# EAGLE design TRV_W5200 (EAGLE 6.4)

## Sheet 1 of 2
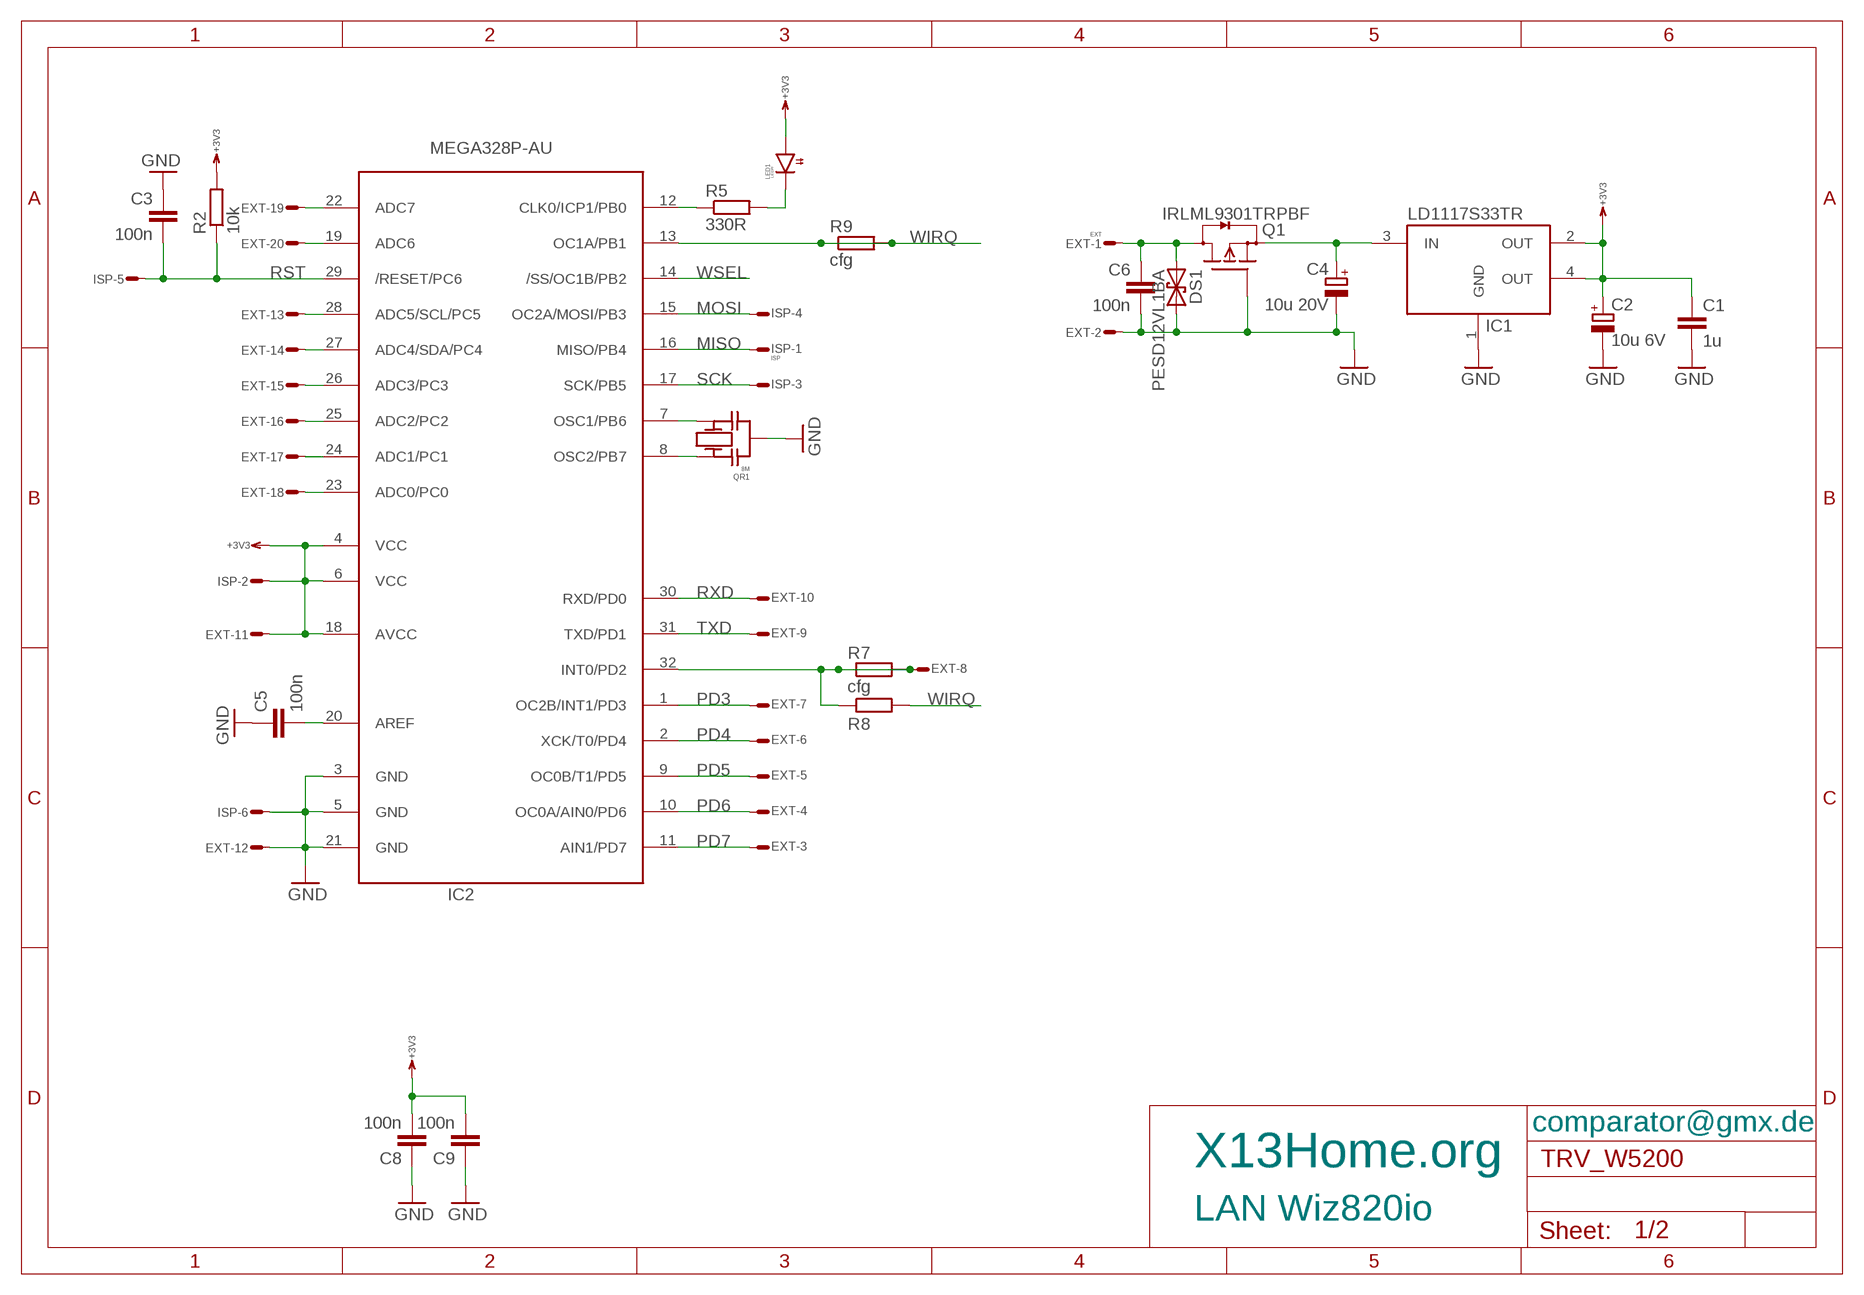
[diagram p0: schematic, sheet 1]

### Parts
C1  1u  C0603  [0603]
C2  10u 6V  C_POLSMCA  [SMC_A]
C3  100n  C0603  [0603]
C4  10u 20V  C_POLSMCB  [SMC_B]
C5  100n  C0603  [0603]
C6  100n  C0603  [0603]
C8  100n  C0603  [0603]
C9  100n  C0603  [0603]
DS1  PESD12VL1BA  TVS-U323  [SOD323]
EXT  EXT  ML20SE  [ML20S]
IC1  LD1117S33TR  LDO_4P  [SOT223]
IC2  MEGA328P-AU  MEGA168PA  [TQFP32-08]
ISP  ISP  ML6ES  [ML6S]
LED1  LEDR  LEDT134  [T1-3/4]
Q1  IRLML9301TRPBF  FET-PDSOT23  [SOT23]
QR1  8M  QRCE  [CSTCE]
R2  10k  R0603  [0603]
R5  330R  R0603  [0603]
R7  cfg  R0402  [0402]
R8  cfg  R0402  [0402]
R9  cfg  R0402  [0402]

### Nets
+3V3: C1.1 C2.+ C8.2 C9.2 EXT.11 IC1.2(OUT) IC1.4(OUT) IC2.4(VCC) IC2.6(VCC) IC2.18(AVCC) ISP.2 LED1.A R2.2 ; also sheet 2
GND: C1.2 C2.- C3.1 C4.- C5.1 C6.2 C8.1 C9.1 DS1.C EXT.2 EXT.12 IC1.1(GND) IC2.3(GND) IC2.5(GND) IC2.21(GND) ISP.6 Q1.1(G) QR1.G(M) ; also sheet 2
MISO: IC2.16(MISO/PB4) ISP.1 ; also sheet 2
MOSI: IC2.15(OC2A/MOSI/PB3) ISP.4 ; also sheet 2
N$2: C6.1 DS1.A EXT.1 Q1.3(D)
N$3: EXT.19 IC2.22(ADC7)
N$4: C4.+ IC1.3(IN) Q1.2(S)
N$6: C5.2 IC2.20(AREF)
N$7: IC2.8(OSC2/PB7) QR1.A
N$8: IC2.7(OSC1/PB6) QR1.B
N$10: IC2.12(CLK0/ICP1/PB0) R5.1
N$11: EXT.8 IC2.32(INT0/PD2) R7.1 R7.2 R8.1
N$15: EXT.20 IC2.19(ADC6)
N$21: LED1.C R5.2
PC0: EXT.18 IC2.23(ADC0/PC0)
PC1: EXT.17 IC2.24(ADC1/PC1)
PC2: EXT.16 IC2.25(ADC2/PC2)
PC3: EXT.15 IC2.26(ADC3/PC3)
PC4: EXT.14 IC2.27(ADC4/SDA/PC4)
PC5: EXT.13 IC2.28(ADC5/SCL/PC5)
PD3: EXT.7 IC2.1(OC2B/INT1/PD3)
PD4: EXT.6 IC2.2(XCK/T0/PD4)
PD5: EXT.5 IC2.9(OC0B/T1/PD5)
PD6: EXT.4 IC2.10(OC0A/AIN0/PD6)
PD7: EXT.3 IC2.11(AIN1/PD7)
RST: C3.2 IC2.29(/RESET/PC6) ISP.5 R2.1
RXD: EXT.10 IC2.30(RXD/PD0)
SCK: IC2.17(SCK/PB5) ISP.3 ; also sheet 2
TXD: EXT.9 IC2.31(TXD/PD1)
WIRQ: IC2.13(OC1A/PB1) R8.2 R9.1 R9.2 ; also sheet 2
WSEL: IC2.14(/SS/OC1B/PB2) ; also sheet 2

### Notes on the sheet
- comparator@gmx.de
- X13Home.org
- LAN Wiz820io

## Sheet 2 of 2
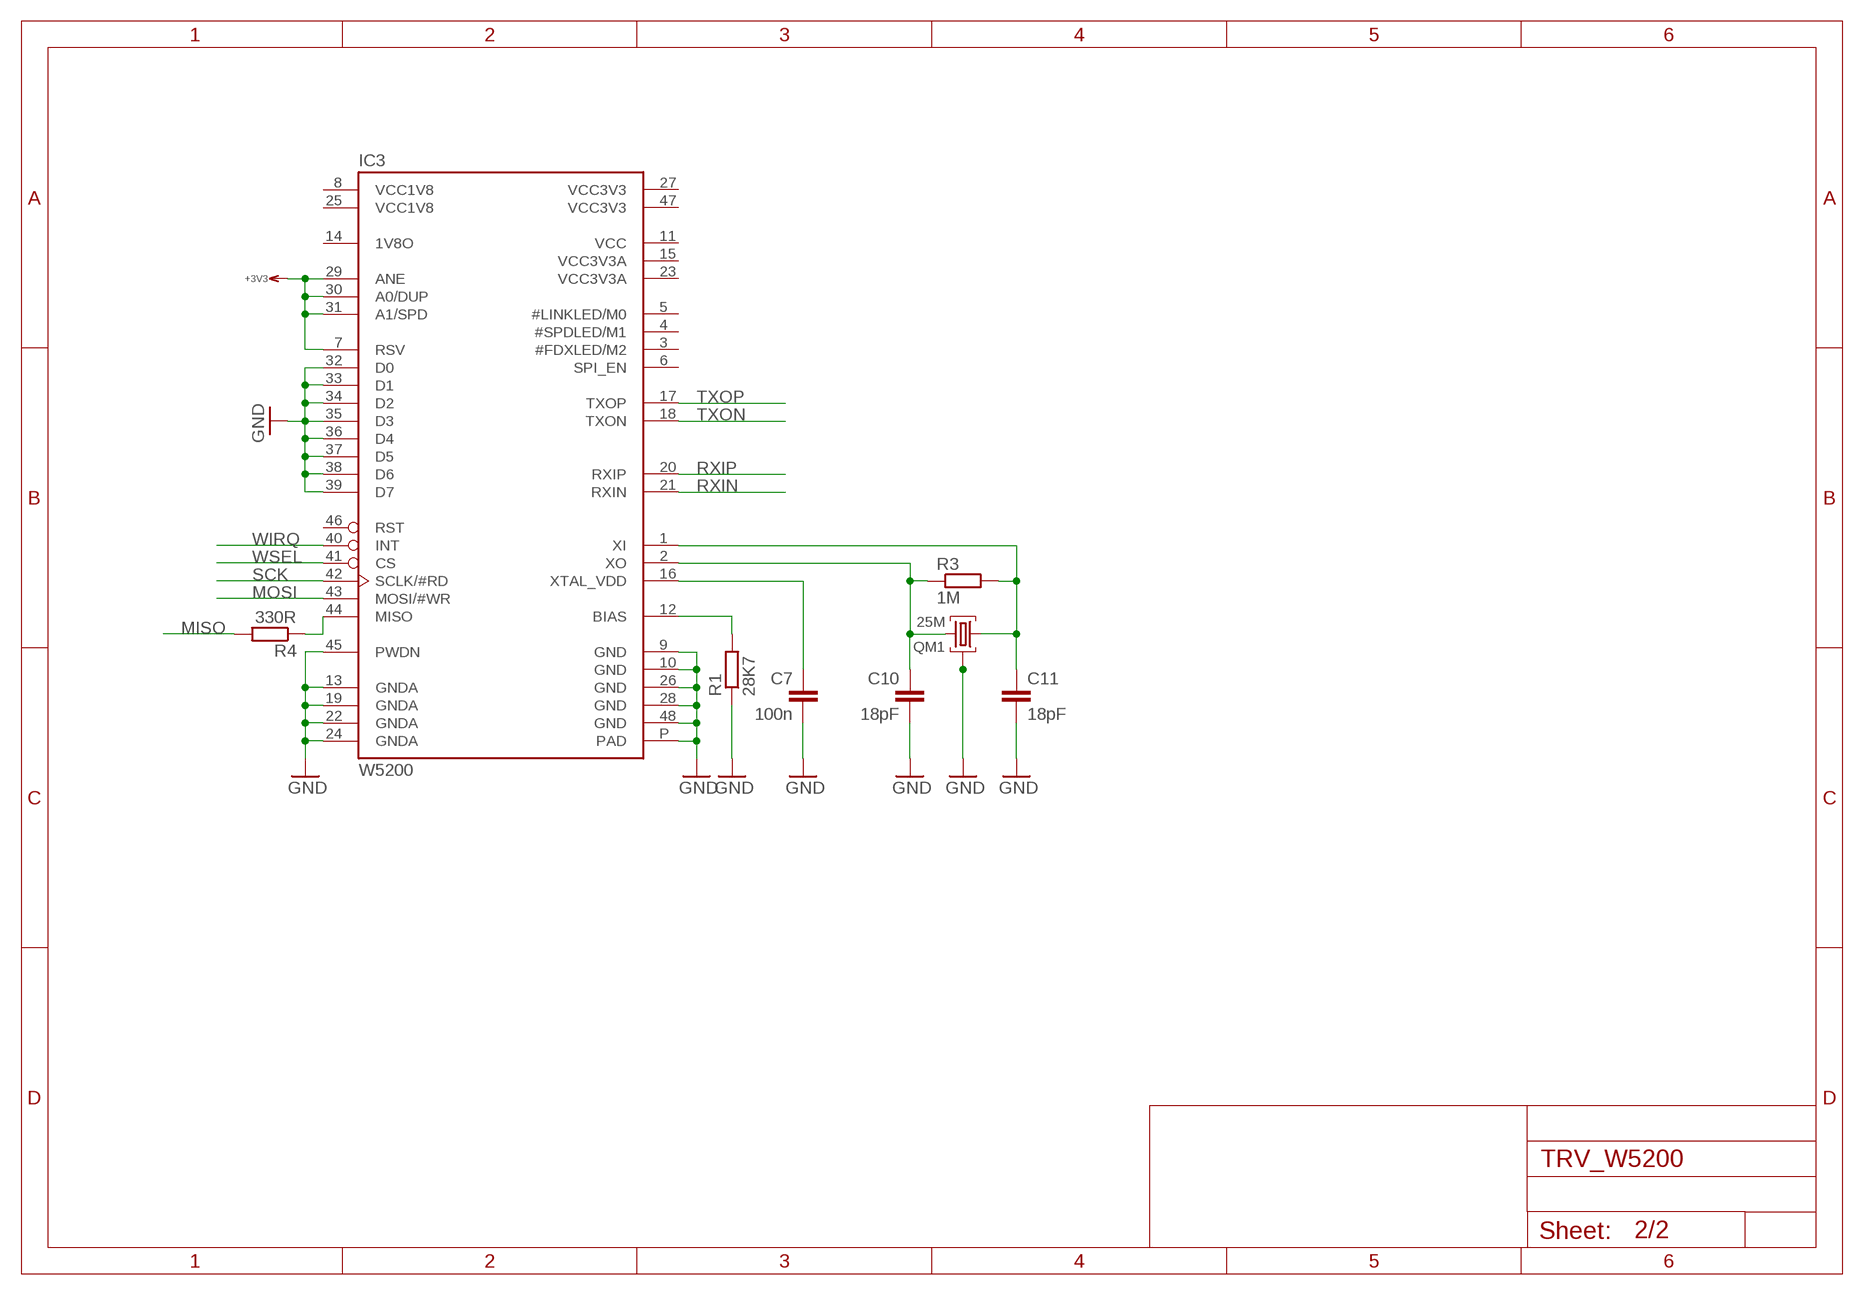
[diagram p1: schematic, sheet 2]

### Parts
C7  100n  C0603  [0603]
C10  18pF  C0603  [0603]
C11  18pF  C0603  [0603]
IC3  W5200  [QFN48]
QM1  25M  QM3.2X2.5  [SMD_4P_3.2X2.5]
R1  28K7  R0603  [0603]
R3  1M  R0603  [0603]
R4  330R  R0603  [0603]

### Nets
+3V3: IC3.7(RSV) IC3.29(ANE) IC3.30(A0/DUP) IC3.31(A1/SPD) ; also sheet 1
GND: C7.2 C10.2 C11.2 IC3.9(GND) IC3.10(GND) IC3.13(GNDA) IC3.19(GNDA) IC3.22(GNDA) IC3.24(GNDA) IC3.26(GND) IC3.28(GND) IC3.32(D0) IC3.33(D1) IC3.34(D2) IC3.35(D3) IC3.36(D4) IC3.37(D5) IC3.38(D6) IC3.39(D7) IC3.45(PWDN) IC3.48(GND) IC3.P(PAD) QM1.2(M1) QM1.4(M2) R1.1 ; also sheet 1
MISO: R4.2 ; also sheet 1
MOSI: IC3.43(MOSI/#WR) ; also sheet 1
N$1: IC3.12(BIAS) R1.2
N$5: C7.1 IC3.16(XTAL_VDD)
N$9: C10.1 IC3.2(XO) QM1.3 R3.1
N$12: C11.1 IC3.1(XI) QM1.1 R3.2
N$13: IC3.44(MISO) R4.1
RXIN: IC3.21(RXIN)
RXIP: IC3.20(RXIP)
SCK: IC3.42(SCLK/#RD) ; also sheet 1
TXON: IC3.18(TXON)
TXOP: IC3.17(TXOP)
WIRQ: IC3.40(INT) ; also sheet 1
WSEL: IC3.41(CS) ; also sheet 1
Unconnected: IC3.3(#FDXLED/M2) IC3.4(#SPDLED/M1) IC3.5(#LINKLED/M0) IC3.6(SPI_EN) IC3.8(VCC1V8) IC3.11(VCC) IC3.14(1V8O) IC3.15(VCC3V3A) IC3.23(VCC3V3A) IC3.25(VCC1V8) IC3.27(VCC3V3) IC3.46(RST) IC3.47(VCC3V3)

## Library data of the parts
C1 C3 C5-C11 = RCL:C: Capacitor SMD
C2 C4 = RCL:C_POL: POLARIZED CAPACITOR, European symbol
DS1 = Diode:TVS-U: DIODE
EXT = Conn:ML20?E: HARTING
IC1 = DCDC:LDO_4P
IC2 = atmel:MEGA168P: MCU, 4/8/16k, TQFP32
IC3 = Other:W5200
ISP = Conn:ML6E: HARTING
LED1 = Optic:LED
Q1 = Transistor:FET-PD
QM1 = QUARTZ:QM
QR1 = QUARTZ:QR
R1-R5 R7-R9 = RCL:R: Resistor SMD

## Board
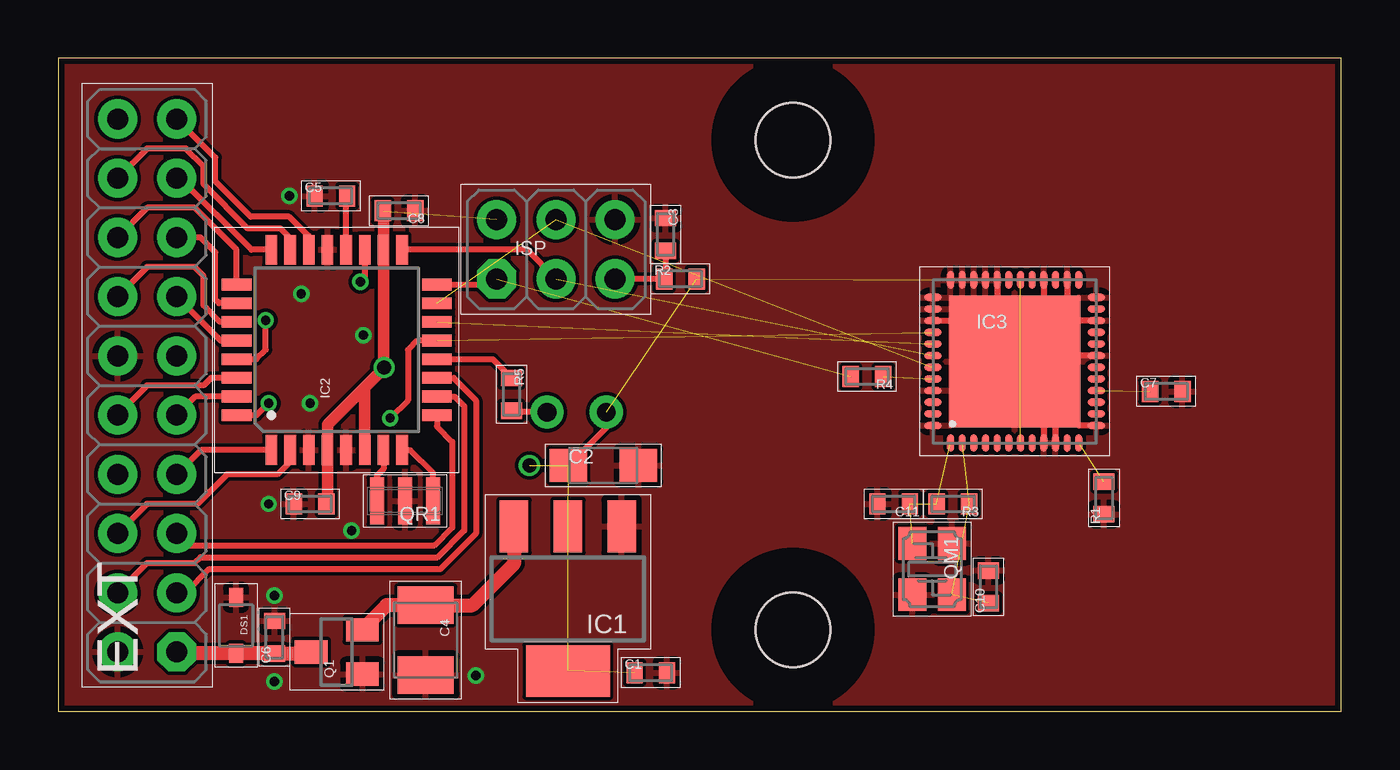
[diagram p2: board, top side]
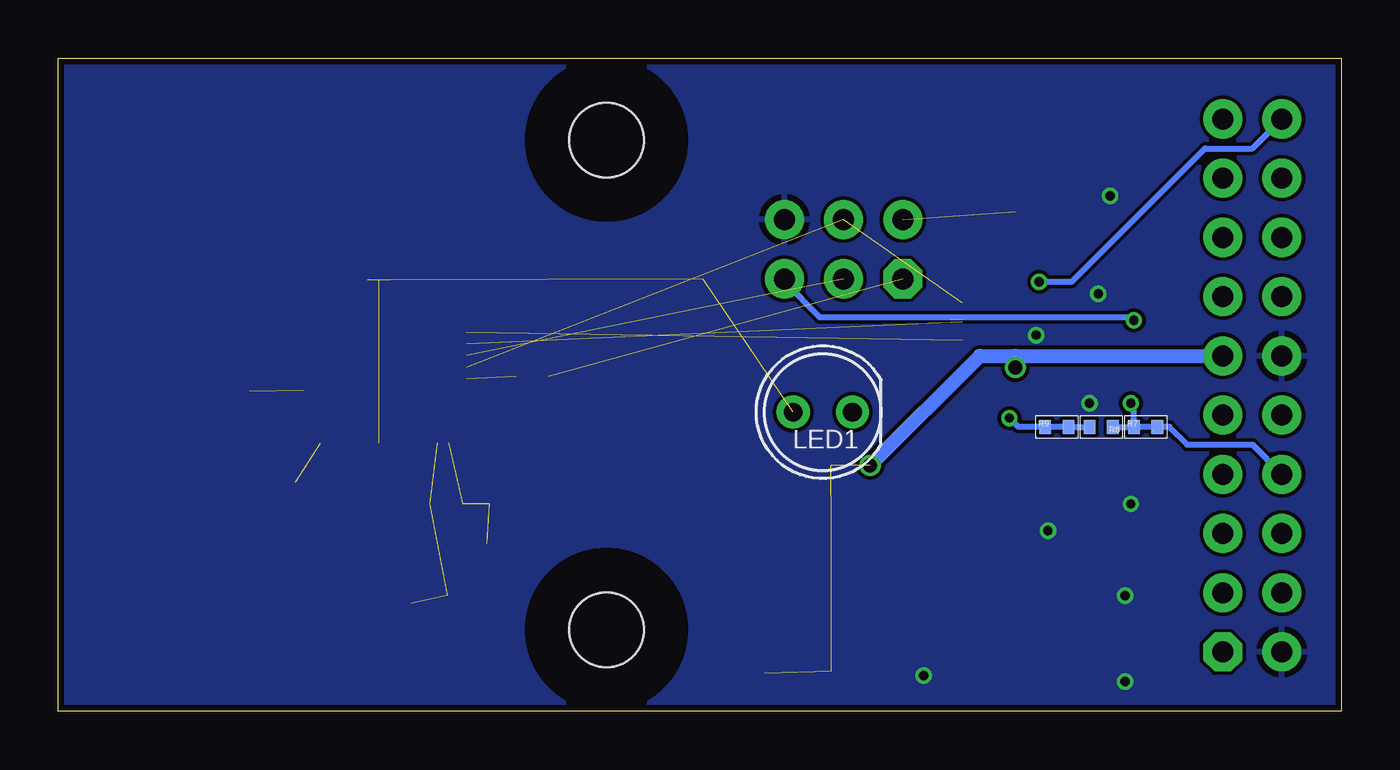
[diagram p3: board, bottom side, seen from below]

Size 55 x 28 mm. Coordinates in mm from the lower left corner, seen from the top.
Outline: 0,0 55,0 55,28 0,28 0,0
Copper layers (1*16): Top 0.035mm / dielectric 1.5mm / Bottom 0.035mm
Design rules "ITEADstudio_DRC *": minimum track width 6mil, minimum drill 12mil, track to track 6mil, track to pad 6mil, pad to pad 6mil, via to via 6mil, smd to smd 0mil, copper to edge 10mil, drill to drill 10mil, minimum pad ring 10mil, minimum via ring 6mil, stop-mask expansion 2mil, vias tented up to drill 100mil, thermal gap 10mil
Holes 3.2 mm at 31.5,24.5 31.5,3.5
tRestrict: area 28,0 to 35,7; area 28,21 to 35,28
bRestrict: area 28,21 to 35,28; area 28,0 to 35,7

### Footprints (pad centres in the part's own frame; a part is rotated, then mirrored left to right if it is on the bottom)
0603 = smd 0.7 x 0.9: 1 -0.697,0; 2 0.697,0
SMC_A = smd 1.6 x 1.4: + -1.5,0; - 1.5,0
SMC_B = smd 1.6 x 2.4: + -1.5,0; - 1.5,0
SOD323 = smd 0.8 x 0.6: A 1.2,0; C -1.2,0
ML20S = drill 0.9 pad 1.676 octagon: 1 -11.43,-1.27 | drill 0.9 pad 1.676: 2 -11.43,1.27; 3 -8.89,-1.27; 4 -8.89,1.27; 5 -6.35,-1.27; 6 -6.35,1.27; 7 -3.81,-1.27; 8 -3.81,1.27; 9 -1.27,-1.27; 10 -1.27,1.27; 11 1.27,-1.27; 12 1.27,1.27; 13 3.81,-1.27; 14 3.81,1.27; 15 6.35,-1.27; 16 6.35,1.27; 17 8.89,-1.27; 18 8.89,1.27; 19 11.43,-1.27; 20 11.43,1.27
SOT223 = smd 1.219 x 2.235: 1 -2.311,-3.099; 2 0,-3.099; 3 2.311,-3.099 | smd 3.6 x 2.2: 4 0,3.099
TQFP32-08 = smd 1.27 x 0.5: 1 -4.293,2.8; 2 -4.293,2; 3 -4.293,1.2; 4 -4.293,0.4; 5 -4.293,-0.4; 6 -4.293,-1.2; 7 -4.293,-2; 8 -4.293,-2.8; 17 4.293,-2.8; 18 4.293,-2; 19 4.293,-1.2; 20 4.293,-0.4; 21 4.293,0.4; 22 4.293,1.2; 23 4.293,2; 24 4.293,2.8 | smd 0.5 x 1.27: 9 -2.8,-4.293; 10 -2,-4.293; 11 -1.2,-4.293; 12 -0.4,-4.293; 13 0.4,-4.293; 14 1.2,-4.293; 15 2,-4.293; 16 2.8,-4.293; 25 2.8,4.293; 26 2,4.293; 27 1.2,4.293; 28 0.4,4.293; 29 -0.4,4.293; 30 -1.2,4.293; 31 -2,4.293; 32 -2.8,4.293
QFN48 = smd 0.3 x 0.75: 1 -2.75,-3.5; 2 -2.25,-3.5; 3 -1.75,-3.5; 4 -1.25,-3.5; 5 -0.75,-3.5; 6 -0.25,-3.5; 7 0.25,-3.5; 8 0.75,-3.5; 9 1.25,-3.5; 10 1.75,-3.5; 11 2.25,-3.5; 12 2.75,-3.5; 25 2.75,3.5; 26 2.25,3.5; 27 1.75,3.5; 28 1.25,3.5; 29 0.75,3.5; 30 0.25,3.5; 31 -0.25,3.5; 32 -0.75,3.5; 33 -1.25,3.5; 34 -1.75,3.5; 35 -2.25,3.5; 36 -2.75,3.5 | smd 0.75 x 0.3: 13 3.5,-2.75; 14 3.5,-2.25; 15 3.5,-1.75; 16 3.5,-1.25; 17 3.5,-0.75; 18 3.5,-0.25; 19 3.5,0.25; 20 3.5,0.75; 21 3.5,1.25; 22 3.5,1.75; 23 3.5,2.25; 24 3.5,2.75; 37 -3.5,2.75; 38 -3.5,2.25; 39 -3.5,1.75; 40 -3.5,1.25; 41 -3.5,0.75; 42 -3.5,0.25; 43 -3.5,-0.25; 44 -3.5,-0.75; 45 -3.5,-1.25; 46 -3.5,-1.75; 47 -3.5,-2.25; 48 -3.5,-2.75 | smd 5.65 x 5.65: P 0,0
ML6S = drill 0.9 pad 1.676 octagon: 1 -2.54,-1.27 | drill 0.9 pad 1.676: 2 -2.54,1.27; 3 0,-1.27; 4 0,1.27; 5 2.54,-1.27; 6 2.54,1.27
T1-3/4 = drill 0.8 pad 1.422: A 1.27,0; C -1.27,0
SOT23 = smd 1 x 1.4: 1 -0.95,-1.1; 2 0.95,-1.1; 3 0,1.1
SMD_4P_3.2X2.5 = smd 1.4 x 1.2: 1 -1.1,-0.85; 2 1.1,-0.85; 3 1.1,0.85; 4 -1.1,0.85
CSTCE = smd 0.6 x 2: A -1.2,0; B 1.2,0; G 0,0
0402 = smd 0.5 x 0.6: 1 -0.5,0; 2 0.5,0

### Placement (x,y rotation side)
C1  25.4,1.65 0 top
C2  23.37,10.54 0 top
C3  26.04,20.45 270 top
C4  15.75,3.05 270 top
C5  11.68,22.1 0 top
C6  9.27,3.17 90 top
C7  47.5,13.72 0 top
C8  14.61,21.46 180 top
C9  10.79,8.89 0 top
C10  39.88,5.33 90 top
C11  35.81,8.89 180 top
DS1  7.62,3.68 270 top
EXT  3.81,13.97 90 top
IC1  21.84,4.83 180 top
IC2  11.94,15.49 90 top
IC3  41,15 0 top
ISP  21.34,19.81 0 top
LED1  22.23,12.83 180 bottom
Q1  11.94,2.54 90 top
QM1  37.47,6.1 270 top
QR1  14.86,9.02 180 top
R1  44.83,9.14 90 top
R2  26.67,18.54 0 top
R3  38.35,8.89 180 top
R4  34.67,14.35 180 top
R5  19.43,13.59 270 top
R7  8.38,12.19 0 bottom
R8  10.29,12.19 180 bottom
R9  12.19,12.19 0 bottom

### Tracks (layer width: path | path; a pad name or v marks a point on that pad's centre or on a via)
+3V3  (via drill 0.6)  (10 unrouted)
  Top 0.254: LED1.A 23.5,12.17 C2.+
  Top 0.406: 11.54,8.94 C9.2 | v13.97,14.73 13.94,14.73
  Top 0.483: C8.2 13.94,21.43 IC2.18 13.94,14.73 13.94,14.7 13.08,13.84 | 13.08,13.84 11.54,12.3 IC2.4 11.54,8.94 | IC2.6 13.14,13.79 13.08,13.84
  Bottom 0.61: v20.19,10.54 15.49,15.24 13.97,15.24 | 13.97,15.24 EXT.11 | v13.97,14.73 13.97,15.24
GND  (via drill 0.4)
  Top 0.254: IC3.22 43.62,16.75 | IC3.26 43.25,17.62 | IC3.28 42.25,17.62 | IC3.32 40.25,17.62 | IC3.39 38.38,16.75 | IC3.10 42.75,12.38 42.82,12.45 43.56,12.45 43.76,12.25 IC3.13 | 42.25,12.38 IC3.9 | IC3.19 41.25,15.25 IC3.P
  other vias: 9.02,8.89 12.57,7.75 9.91,22.1 10.41,17.91 10.79,13.21 13.08,16.13 9.27,4.95 17.91,1.52 9.27,1.27
  pour Top: 0,0 55,0 55,28 0,28
  pour Bottom: 0,0 55,0 55,28 0,28
MISO  (1 unrouted)
  Top 0.254: IC2.16 18.55,18.29 ISP.1
MOSI  (2 unrouted)
N$1  (1 unrouted)
N$2
  Top 0.61: EXT.1 5.14,2.48 DS1.A C6.1 10.78,2.48 Q1.3
N$3
  Top 0.254: IC2.22 10.74,20.38 9.91,21.21 8.26,21.21 6.73,22.73 6.73,23.75 EXT.19
N$4
  Top 0.61: Q1.2 13.04,3.51 14.07,4.55 C4.+ 17.76,4.55 19.53,6.33 IC1.3
N$5  (1 unrouted)
N$6
  Top 0.254: IC2.20 12.34,22.05 C5.2
N$7
  Top 0.254: QR1.A 16.06,10.23 15.09,11.2 IC2.8
N$8
  Top 0.254: QR1.B 13.66,10.1 13.94,10.38 IC2.7
N$9  (3 unrouted)
N$10
  Top 0.254: IC2.12 18.62,15.09 R5.1
N$11  (via drill 0.4)
  Top 0.254: v9.02,13.21 8.5,12.69 IC2.32
  Bottom 0.254: EXT.8 3.81,11.43 6.6,11.43 7.37,12.19 R7.2 R7.1 | R7.1 8.88,13.07 v9.02,13.21 | R8.1 R7.1
N$12  (3 unrouted)
N$13  (1 unrouted)
N$15  (via drill 0.4)
  Top 0.254: IC2.19 13.14,18.6 v12.95,18.41
  Bottom 0.254: v12.95,18.41 11.56,18.41 5.84,24.13 3.81,24.13 EXT.20
N$21
  Top 0.254: LED1.C 19.5,12.83 R5.2
PC0
  Top 0.254: IC2.23 9.94,20.29 9.53,20.7 8.13,20.7 6.22,22.61 6.22,23.37 5.46,24.13 3.81,24.13 EXT.18
PC1
  Top 0.254: IC2.24 8.28,19.79 5.21,22.86 EXT.17
PC2
  Top 0.254: IC2.25 7.64,19.79 5.84,21.59 3.81,21.59 EXT.16
PC3
  Top 0.254: EXT.15 6.1,20.32 6.73,19.68 6.73,17.65 6.89,17.49 IC2.26
PC4
  Top 0.254: EXT.14 3.81,19.05 5.84,19.05 6.22,18.67 6.22,17.4 6.93,16.69 IC2.27
PC5
  Top 0.254: IC2.28 6.97,15.89 EXT.13
PD3
  Top 0.254: IC2.1 6.12,11.2 EXT.7
PD4
  Top 0.254: IC2.2 9.94,10.7 9.4,10.16 7.24,10.16 5.97,8.89 3.81,8.89 EXT.6
PD5
  Top 0.254: EXT.5 5.59,7.11 16.13,7.11 16.89,7.87 16.89,11.56 16.23,12.22 IC2.9
PD6
  Top 0.254: EXT.4 3.81,6.35 5.84,6.35 6.1,6.6 16.26,6.6 17.4,7.75 17.4,13.08 16.99,13.49 IC2.10
PD7
  Top 0.254: IC2.11 16.95,14.29 17.91,13.34 17.91,7.62 16.38,6.1 6.48,6.1 5.46,5.08 EXT.3
RST  (via drill 0.4)
  Top 0.254: IC2.29 8.49,15.09 8.89,15.49 v8.89,16.76 | R2.1 25.91,18.54 | 25.91,18.54 ISP.5 | C3.2 26.04,18.67 25.91,18.54
  Bottom 0.254: v8.89,16.76 9.02,16.89 22.35,16.89 23.88,18.41 ISP.5
RXD
  Top 0.254: IC2.30 6.55,14.29 6.22,13.97 3.81,13.97 EXT.10
SCK  (1 unrouted)
  Top 0.254: ISP.3 20.07,19.81 14.76,19.81 IC2.17
TXD
  Top 0.254: IC2.31 5.87,13.49 EXT.9
WIRQ  (via drill 0.4)  (1 unrouted)
  Top 0.254: IC2.13 15.39,15.89 14.99,15.49 14.99,13.34 v14.22,12.57
  Bottom 0.254: R8.2 R9.2 R9.1 13.84,12.19 v14.22,12.57
WSEL  (1 unrouted)